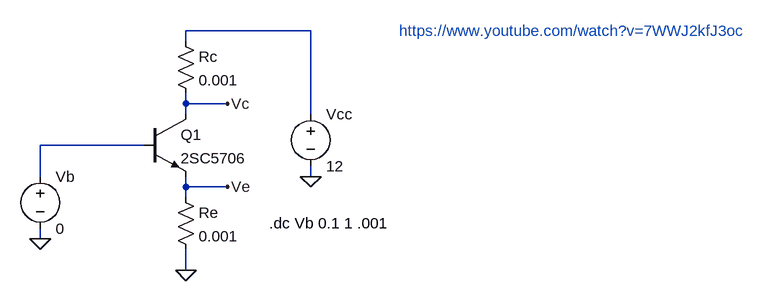
[diagram p0: schematic 2SC5706 Input Characteristic Curve.asc]
2SC5706 Input Characteristic Curve.asc, the LTspice schematic file:
Version 4
SHEET 1 1232 680
WIRE 448 16 256 16
WIRE 256 32 256 16
WIRE 256 128 256 112
WIRE 320 128 256 128
WIRE 256 144 256 128
WIRE 448 144 448 16
WIRE 192 192 32 192
WIRE 32 240 32 192
WIRE 448 240 448 224
WIRE 256 256 256 240
WIRE 320 256 256 256
WIRE 256 272 256 256
WIRE 32 336 32 320
WIRE 256 384 256 352
FLAG 256 384 0
FLAG 448 240 0
FLAG 32 336 0
FLAG 320 128 Vc
FLAG 320 256 Ve
SYMBOL npn 192 144 R0
SYMATTR InstName Q1
SYMATTR Value 2SC5706
SYMBOL voltage 448 128 R0
WINDOW 123 0 0 Left 2
WINDOW 39 0 0 Left 2
SYMATTR InstName Vcc
SYMATTR Value 12
SYMBOL res 240 16 R0
SYMATTR InstName Rc
SYMATTR Value 0.001
SYMBOL voltage 32 224 R0
WINDOW 123 0 0 Left 2
WINDOW 39 0 0 Left 2
SYMATTR InstName Vb
SYMATTR Value 0
SYMBOL res 240 256 R0
SYMATTR InstName Re
SYMATTR Value 0.001
TEXT 384 312 Left 2 !.dc Vb 0.1 1 .001
TEXT 584 16 Left 2 ;https://www.youtube.com/watch?v=7WWJ2kfJ3oc

The netlist it stands for:
* 2SC5706 Input Characteristic Curve.asc
Q1 Vc N002 Ve 0 2SC5706
Vcc N001 0 12
Rc N001 Vc 0.001
Vb N002 0 0
Re Ve 0 0.001
.model NPN NPN
.model PNP PNP
.lib standard.bjt
.dc Vb 0.1 1 .001
* https://www.youtube.com/watch?v=7WWJ2kfJ3oc
.backanno
.end